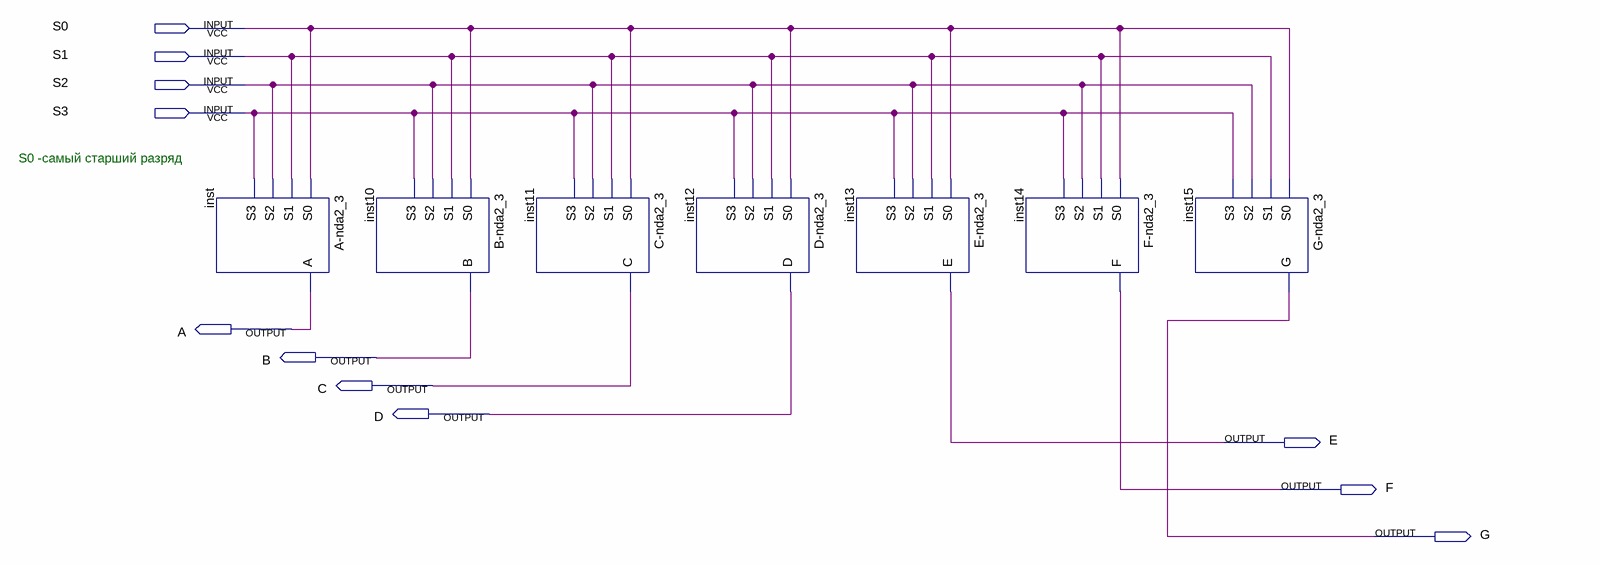
[diagram p0: schematic sheet]
// Quartus schematic decoder_nda2_3.bdf as structural Verilog: 7 symbols, 11 pins
module decoder_nda2_3 (
  input  S0,
  input  S1,
  input  S2,
  input  S3,
  output A,
  output B,
  output C,
  output D,
  output E,
  output F,
  output G
);

  \A-nda2_3  inst (.S0(S0), .S1(S1), .S2(S2), .S3(S3), .A(A));
  \B-nda2_3  inst10 (.S0(S0), .S1(S1), .S2(S2), .S3(S3), .B(B));
  \C-nda2_3  inst11 (.S0(S0), .S1(S1), .S2(S2), .S3(S3), .C(C));
  \D-nda2_3  inst12 (.S0(S0), .S1(S1), .S2(S2), .S3(S3), .D(D));
  \E-nda2_3  inst13 (.S0(S0), .S1(S1), .S2(S2), .S3(S3), .E(E));
  \F-nda2_3  inst14 (.S0(S0), .S1(S1), .S2(S2), .S3(S3), .F(F));
  \G-nda2_3  inst15 (.S0(S0), .S1(S1), .S2(S2), .S3(S3), .G(G));

  // Notes on the sheet:
  //   S0 -самый старший разряд
endmodule
